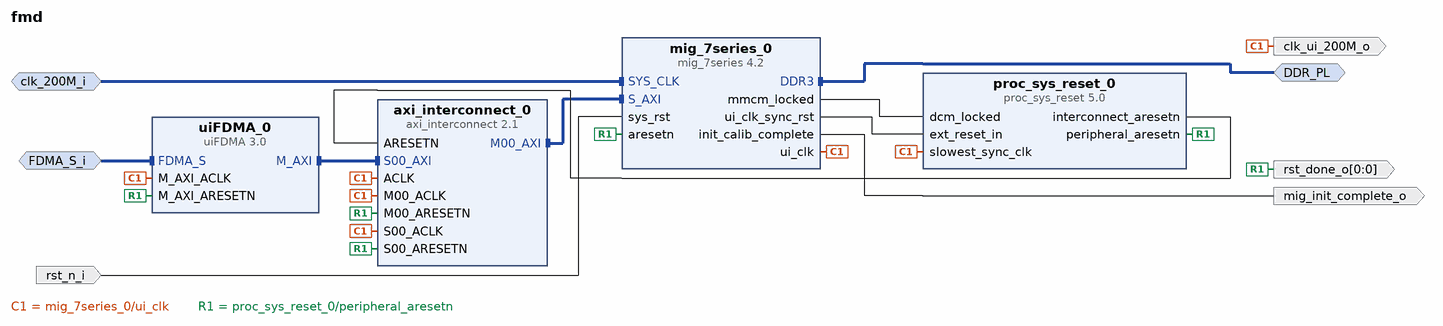
[diagram p0: block diagram of the top level]
# Vivado block design fmd, xc7z100ffg900-2, Vivado 2021.2
create_bd_design fmd

create_bd_intf_port -mode Master -vlnv xilinx.com:interface:ddrx_rtl:1.0 DDR_PL
create_bd_intf_port -mode Slave -vlnv xilinx.com:user:FDMA_rtl:1.0 FDMA_S_i
create_bd_intf_port -mode Slave -vlnv xilinx.com:interface:diff_clock_rtl:1.0 clk_200M_i
create_bd_port -dir O mig_init_complete_o
create_bd_port -dir O -type clk clk_ui_200M_o
set_property -dict {CONFIG.FREQ_HZ 200000000} [get_bd_ports clk_ui_200M_o]
create_bd_port -dir I -type rst rst_n_i
create_bd_port -dir O -from 0 -to 0 -type rst rst_done_o

create_bd_cell -type ip -vlnv xilinx.com:ip:mig_7series:4.2 mig_7series_0
set_property -dict [list \
  CONFIG.BOARD_MIG_PARAM Custom \
  CONFIG.MIG_DONT_TOUCH_PARAM Custom \
  CONFIG.RESET_BOARD_INTERFACE Custom \
  CONFIG.XML_INPUT_FILE mig_b.prj \
] [get_bd_cells mig_7series_0]
create_bd_cell -type ip -vlnv xilinx.com:ip:proc_sys_reset:5.0 proc_sys_reset_0
create_bd_cell -type ip -vlnv xilinx.com:ip:axi_interconnect:2.1 axi_interconnect_0
set_property -dict {CONFIG.NUM_MI 1 CONFIG.S00_HAS_DATA_FIFO 2 CONFIG.S00_HAS_REGSLICE 1} [get_bd_cells axi_interconnect_0]
create_bd_cell -type ip -vlnv xilinx.com:user:uiFDMA:3.0 uiFDMA_0

# ---- connections ----

connect_bd_intf_net -intf_net FDMA_S_0_1 [get_bd_intf_ports FDMA_S_i] [get_bd_intf_pins uiFDMA_0/FDMA_S]
connect_bd_intf_net -intf_net SYS_CLK_0_1 [get_bd_intf_ports clk_200M_i] [get_bd_intf_pins mig_7series_0/SYS_CLK]
connect_bd_intf_net [get_bd_intf_pins axi_interconnect_0/M00_AXI] [get_bd_intf_pins mig_7series_0/S_AXI]
connect_bd_intf_net [get_bd_intf_ports DDR_PL] [get_bd_intf_pins mig_7series_0/DDR3]
connect_bd_intf_net [get_bd_intf_pins uiFDMA_0/M_AXI] [get_bd_intf_pins axi_interconnect_0/S00_AXI]
connect_bd_net [get_bd_pins mig_7series_0/init_calib_complete] [get_bd_ports mig_init_complete_o]
connect_bd_net [get_bd_pins mig_7series_0/mmcm_locked] [get_bd_pins proc_sys_reset_0/dcm_locked]
connect_bd_net [get_bd_pins mig_7series_0/ui_clk] \
  [get_bd_ports clk_ui_200M_o] [get_bd_pins proc_sys_reset_0/slowest_sync_clk] [get_bd_pins axi_interconnect_0/ACLK] \
  [get_bd_pins axi_interconnect_0/S00_ACLK] [get_bd_pins axi_interconnect_0/M00_ACLK] [get_bd_pins uiFDMA_0/M_AXI_ACLK]
connect_bd_net [get_bd_pins mig_7series_0/ui_clk_sync_rst] [get_bd_pins proc_sys_reset_0/ext_reset_in]
connect_bd_net [get_bd_pins proc_sys_reset_0/interconnect_aresetn] [get_bd_pins axi_interconnect_0/ARESETN]
connect_bd_net [get_bd_pins proc_sys_reset_0/peripheral_aresetn] \
  [get_bd_ports rst_done_o] [get_bd_pins mig_7series_0/aresetn] [get_bd_pins uiFDMA_0/M_AXI_ARESETN] \
  [get_bd_pins axi_interconnect_0/S00_ARESETN] [get_bd_pins axi_interconnect_0/M00_ARESETN]
connect_bd_net -net sys_rst_0_1 [get_bd_ports rst_n_i] [get_bd_pins mig_7series_0/sys_rst]

# ---- address map ----
assign_bd_address -offset 0x80000000 -range 64K -target_address_space [get_bd_addr_spaces uiFDMA_0/M_AXI] [get_bd_addr_segs mig_7series_0/memmap/memaddr]

validate_bd_design
save_bd_design
